# Altium schematic sheet power_generation.SchDoc: Triumvi - Power
size Letter; Author: Ye-Sheng Kuo; Revision: 11; SheetNumber: 2; SheetTotal: 10
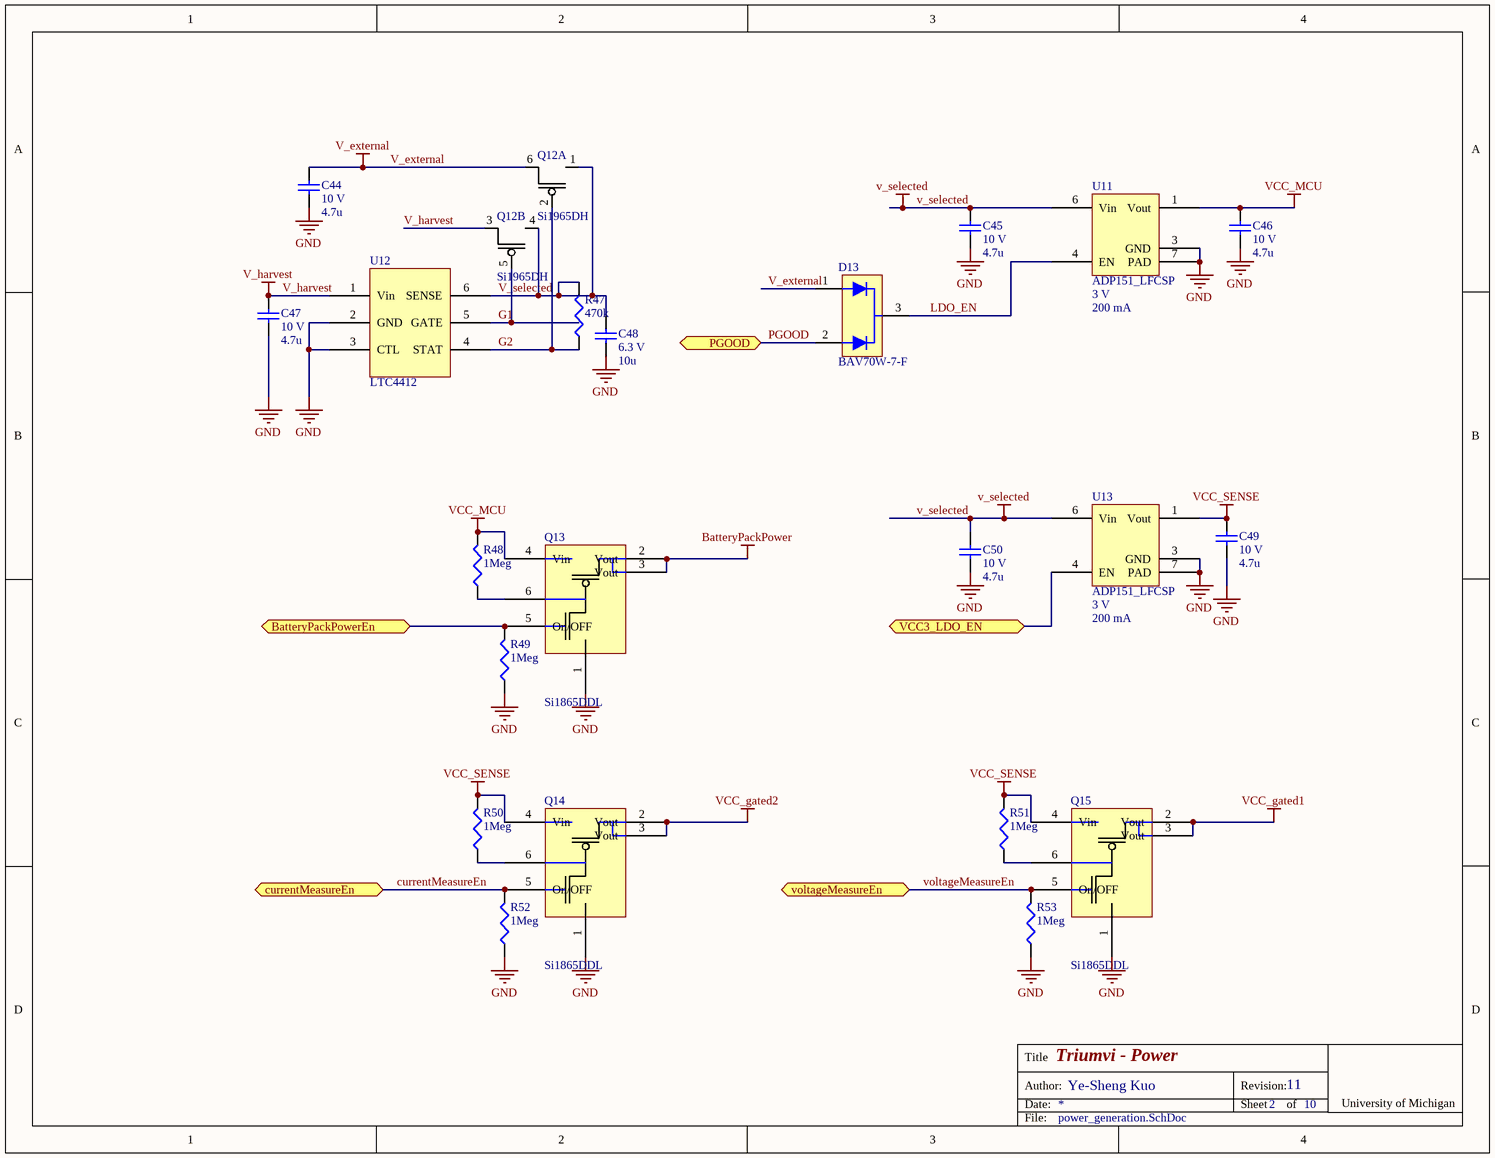
[diagram p0: power_generation.SchDoc]

## Parts
C44  voltage rated: 10 V  [0603]  (hidden comment: 4.7u)
C45  voltage rated: 10 V  [0603]  (hidden comment: 4.7u)
C46  voltage rated: 10 V  [0603]  (hidden comment: 4.7u)
C47  voltage rated: 10 V  [0603]  (hidden comment: 4.7u)
C48  voltage rated: 6.3 V  [0603]  (hidden comment: 10u)
C49  voltage rated: 10 V  [0603]  (hidden comment: 4.7u)
C50  voltage rated: 10 V  [0603]  (hidden comment: 4.7u)
D13  BAV70W-7-F  [SOT323]
Q12  Si1965DH  [SC70-6]  (parts A,B of 2)
Q13  Si1865DDL  [SC70-6]
Q14  Si1865DDL  [SC70-6]
Q15  Si1865DDL  [SC70-6]
R47  470k  [0402]
R48  1Meg  [0402]
R49  1Meg  [0402]
R50  1Meg  [0402]
R51  1Meg  [0402]
R52  1Meg  [0402]
R53  1Meg  [0402]
U11  ADP151_LFCSP  Voltage: 3 V  Current: 200 mA  [CP-6-3]
U12  LTC4412  [TSOT-23]
U13  ADP151_LFCSP  Voltage: 3 V  Current: 200 mA  [CP-6-3]

## Ports
BatteryPackPowerEn, currentMeasureEn, PGOOD, VCC3_LDO_EN, voltageMeasureEn

## Nets
BatteryPackPower: Q13.2(Vout) Q13.3(Vout)
GND: C44.2 C45.2 C46.2 C47.2 C48.2 C49.2 C50.2 Q13.1(S1) Q14.1(S1) Q15.1(S1) R49.2 R52.2 R53.2 U11.3(GND) U11.7(PAD) U12.2(GND) U12.3(CTL) U13.3(GND) U13.7(PAD)
V_external: C44.1 D13.1 Q12.6(D1)
V_harvest: C47.1 Q12.3(D2) U12.1(Vin)
v_selected: C45.1 C48.1 C50.1 Q12.1(S1) Q12.4(S2) R47.1 U11.6(Vin) U12.6(SENSE) U13.6(Vin)
VCC_gated1: Q15.2(Vout) Q15.3(Vout)
VCC_gated2: Q14.2(Vout) Q14.3(Vout)
VCC_MCU: C46.1 Q13.4(Vin) R48.1 U11.1(Vout)
VCC_SENSE: C49.1 Q14.4(Vin) Q15.4(Vin) R50.1 R51.1 U13.1(Vout)
BatteryPackPowerEn: Q13.5(On/OFF) R49.1 ; port BatteryPackPowerEn
currentMeasureEn: Q14.5(On/OFF) R52.1 ; port currentMeasureEn
G1: Q12.5(G2) U12.5(GATE)
G2: Q12.2(G1) R47.2 U12.4(STAT)
LDO_EN: D13.3 U11.4(EN)
PGOOD: D13.2 ; port PGOOD
VCC3_LDO_EN: U13.4(EN) ; port VCC3_LDO_EN
voltageMeasureEn: Q15.5(On/OFF) R53.1 ; port voltageMeasureEn
NetQ13_6: Q13.6(D1) R48.2
NetQ14_6: Q14.6(D1) R50.2
NetQ15_6: Q15.6(D1) R51.2

## Notes on the sheet
- Title
- Date:
- Author:
- Revision:
- Sheet
- of
- University of Michigan
- File:

## Library data of the parts
C44-C47 C49 C50 = CGB3B1X5R1A475K055AC: 4.7µF ±10% 10V Ceramic Capacitor X5R 0603; Manufacture: TDK; tolerance: 10%; package: 0603; Supplier 1: Digi-Key; Supplier Part Number 1: 445-7482-1-ND; Value: 4.7u; Temperature Coefficient: X5R; Manufacturer Part Number: CGB3B1X5R1A475K055AC
C48 = C1608X5R0J106M080AB: 10µF ±20% 6.3V Ceramic Capacitor X5R 0603; Manufacture: TDK; tolerance: 20%; package: 0603; Temperature Coefficient: X5R; Supplier 1: Digi-Key; Supplier Part Number 1: 445-4112-1-ND; Value: 10u; Manufacturer Part Number: C1608X5R0J106M080AB
D13 = BAV70W-7-F: Diode Array 1 Pair Common Cathode Standard 75V 150mA Surface Mount SC-70, SOT-323; Manufacturer: Diodes Incorporated; Forward Voltage @ If: 1.25 V @ 150 mA; Supplier 1: Digi-Key; Supplier Part Number 1: BAV70W-FDICT-ND; Manufacturer Part Number: BAV70W-7-F; current: 150 mA; reverse voltage: 75 V; diode type: Standard
Q12 = Si1965DH: Dual P-Channel 12 V (D-S) MOSFET; Supplier 1: Digi-Key; Supplier Part Number 1: SI1965DH-T1-GE3CT-ND
Q13-Q15 = Si1865DDL: Load Switch with Level-Shift; Supplier 1: Digi-Key; Supplier Part Number 1: SI1865DDL-T1-GE3CT-ND
R47 = CRCW0402470KJNED: RES SMD 470K OHM 5% 1/16W 0402; Manufacturer: Vishay Dale; Temperature Coefficient: 100 ppm/C; Tolerance: 5%; Power: 1/16 W; package: 0402; Supplier 1: Digi-Key; Supplier Part Number 1: 541-470KJCT-ND; value: 470k; Manufacturer Part Number: CRCW0402470KJNED
R48-R53 = CRCW04021M00FKED: RES SMD 1M OHM 1% 1/16W 0402; Manufacturer: Vishay Dale; Temperature Coefficient: 100 ppm/C; Tolerance: 1%; Power: 1/16 W; Supplier 1: Digi-Key; Supplier Part Number 1: 541-1.00MLCT-ND; package: 0402; value: 1Meg; Manufacturer Part Number: CRCW04021M00FKED
U11 U13 = ADP151_LFCSP: Ultralow Noise, 200 mA,  CMOS Linear Regulator; Supplier 1: Digi-Key; Supplier Part Number 1: ADP151ACPZ-3.0-R7CT-ND
U12 = LTC4412: Low Loss PowerPath Controller in ThinSOT; Supplier 1: Digi-Key; Supplier Part Number 1: LTC4412ES6#TRMPBFCT-ND